# Altium schematic sheet GPSpart.SchDoc
size 209 x 297 mm; Scale: {Масш.}; Title1str: {Наименование}; PageSetup: Record=PageOptions|CenterHorizontal=False|CenterVertical=False|PrintScale=0.95|XCorrection=0.00|YCorrection=0.00|PrintKind=1|BorderSize=5000000|LeftOffset=0|BottomOffset=0|Orientation=1|PaperLength=1000|PaperWidth=1000|Scale=100|PaperSource=15|PrintQuality=600|MediaType=1|DitherType=10|PaperKind=A4|PrintScaleMode=1; Title2str: {Наименование}; ProcessInspection: {Т.контр.}; Mass: {Масса}; NormInspection: {Н.контр.}; EngineerName: {Инженер}; Letter1Column: {}; Letter2Column: {}; Letter3Column: {}; DocumentType: {Документ}; DocumentType1str: {Документ}; DocumentType2str: {Документ}
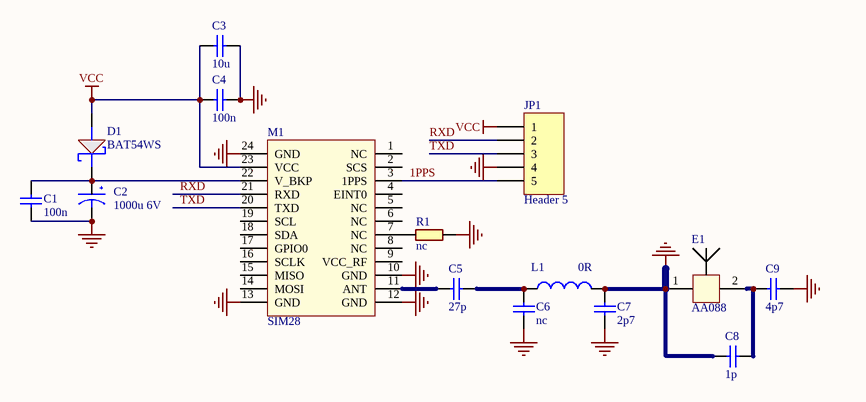
[diagram p0: GPSpart.SchDoc]

## Parts
C1  100n  [CAPC1608X08N]
C2  1000u 6V  [CAPPRD200W50D600H1250]
C3  10u  [CAPC2012X11N]
C4  100n  [CAPC1608X08N]
C5  27p  [CAPC1608X08N]
C6  nc  [CAPC1608X08N]
C7  2p7  [CAPC1608X08N]
C8  1p  [CAPC1005X06N]
C9  4p7  [CAPC1005X06N]
D1  BAT54WS  [DIOM3216X18N]
E1  AA088  [CAPC3216X14N]
JP1  Header 5  [HDRV5W70P254_5X1_1143X254H754]
L1  0R  [INDC1608X10N]
M1  SIM28  [LGA24_GNSS]
R1  nc  [RESC1608X06N]

## Nets
GND: C1.2 C2.1(-) C3.2 C4.2 C6.2 C7.1 C7.2 C8.1 C9.1 E1.1 JP1.4 L1.2 M1.10(GND) M1.12(GND) M1.13(GND) M1.24(GND) R1.2
VCC: C3.1 C4.1 D1.A JP1.1 M1.23(VCC)
1PPS: JP1.5 M1.3(1PPS)
RXD: JP1.2 M1.21(RXD)
TXD: JP1.3 M1.20(TXD)
NetC1_1: C1.1 C2.2(+) D1.K M1.22(V_BKP)
NetC5_1: C5.1 M1.11(ANT)
NetC5_2: C5.2 C6.1 L1.1
NetC8_2: C8.2 C9.2 E1.2
NetM1_7: M1.7(NC) R1.1

Not connected (* = marked no-connect by the designer): M1 1(NC) 2(SCS) 4(EINT0) 5(NC) 6(NC) 8(NC) 9(VCC_RF) 14(MOSI) 15(MISO) 16(SCLK) 17(GPIO0) 18(SDA) 19(SCL)

## Notes on the sheet
- Перв. примен.
- Справ. №
- Подп. и дата
- Инв. № дубл.
- Взам. инв. №
- Изм.
- Лист
- № докум.
- Подп.
- Дата
- Лит.
- Масса
- Масштаб
- Т.контр.
- Пров.
- Разраб.
- Листов
- Инв. № подл.
- Н.контр.
- Утв.
- Копировал
- Формат А4

## Library data of the parts
C1 C3-C9 = CAPN
C2 = C-EL-DIP: Производитель: *; Точность: *; Напряжение: *; Тип диэлектрика: *
D1 = DIODE SCHOTTKY: Text Field1: 30; Text Field2: 20
E1 = AA088: ceramic SMD GPS antenna
JP1 = Header 5: Header, 5-Pin; LatestRevisionDate: 17-Jul-2002; LatestRevisionNote: Re-released for DXP Platform.; Publisher: Altium Limited
L1 = L
R1 = RES